# Altium schematic sheet LedDisp.SchDoc
size A3
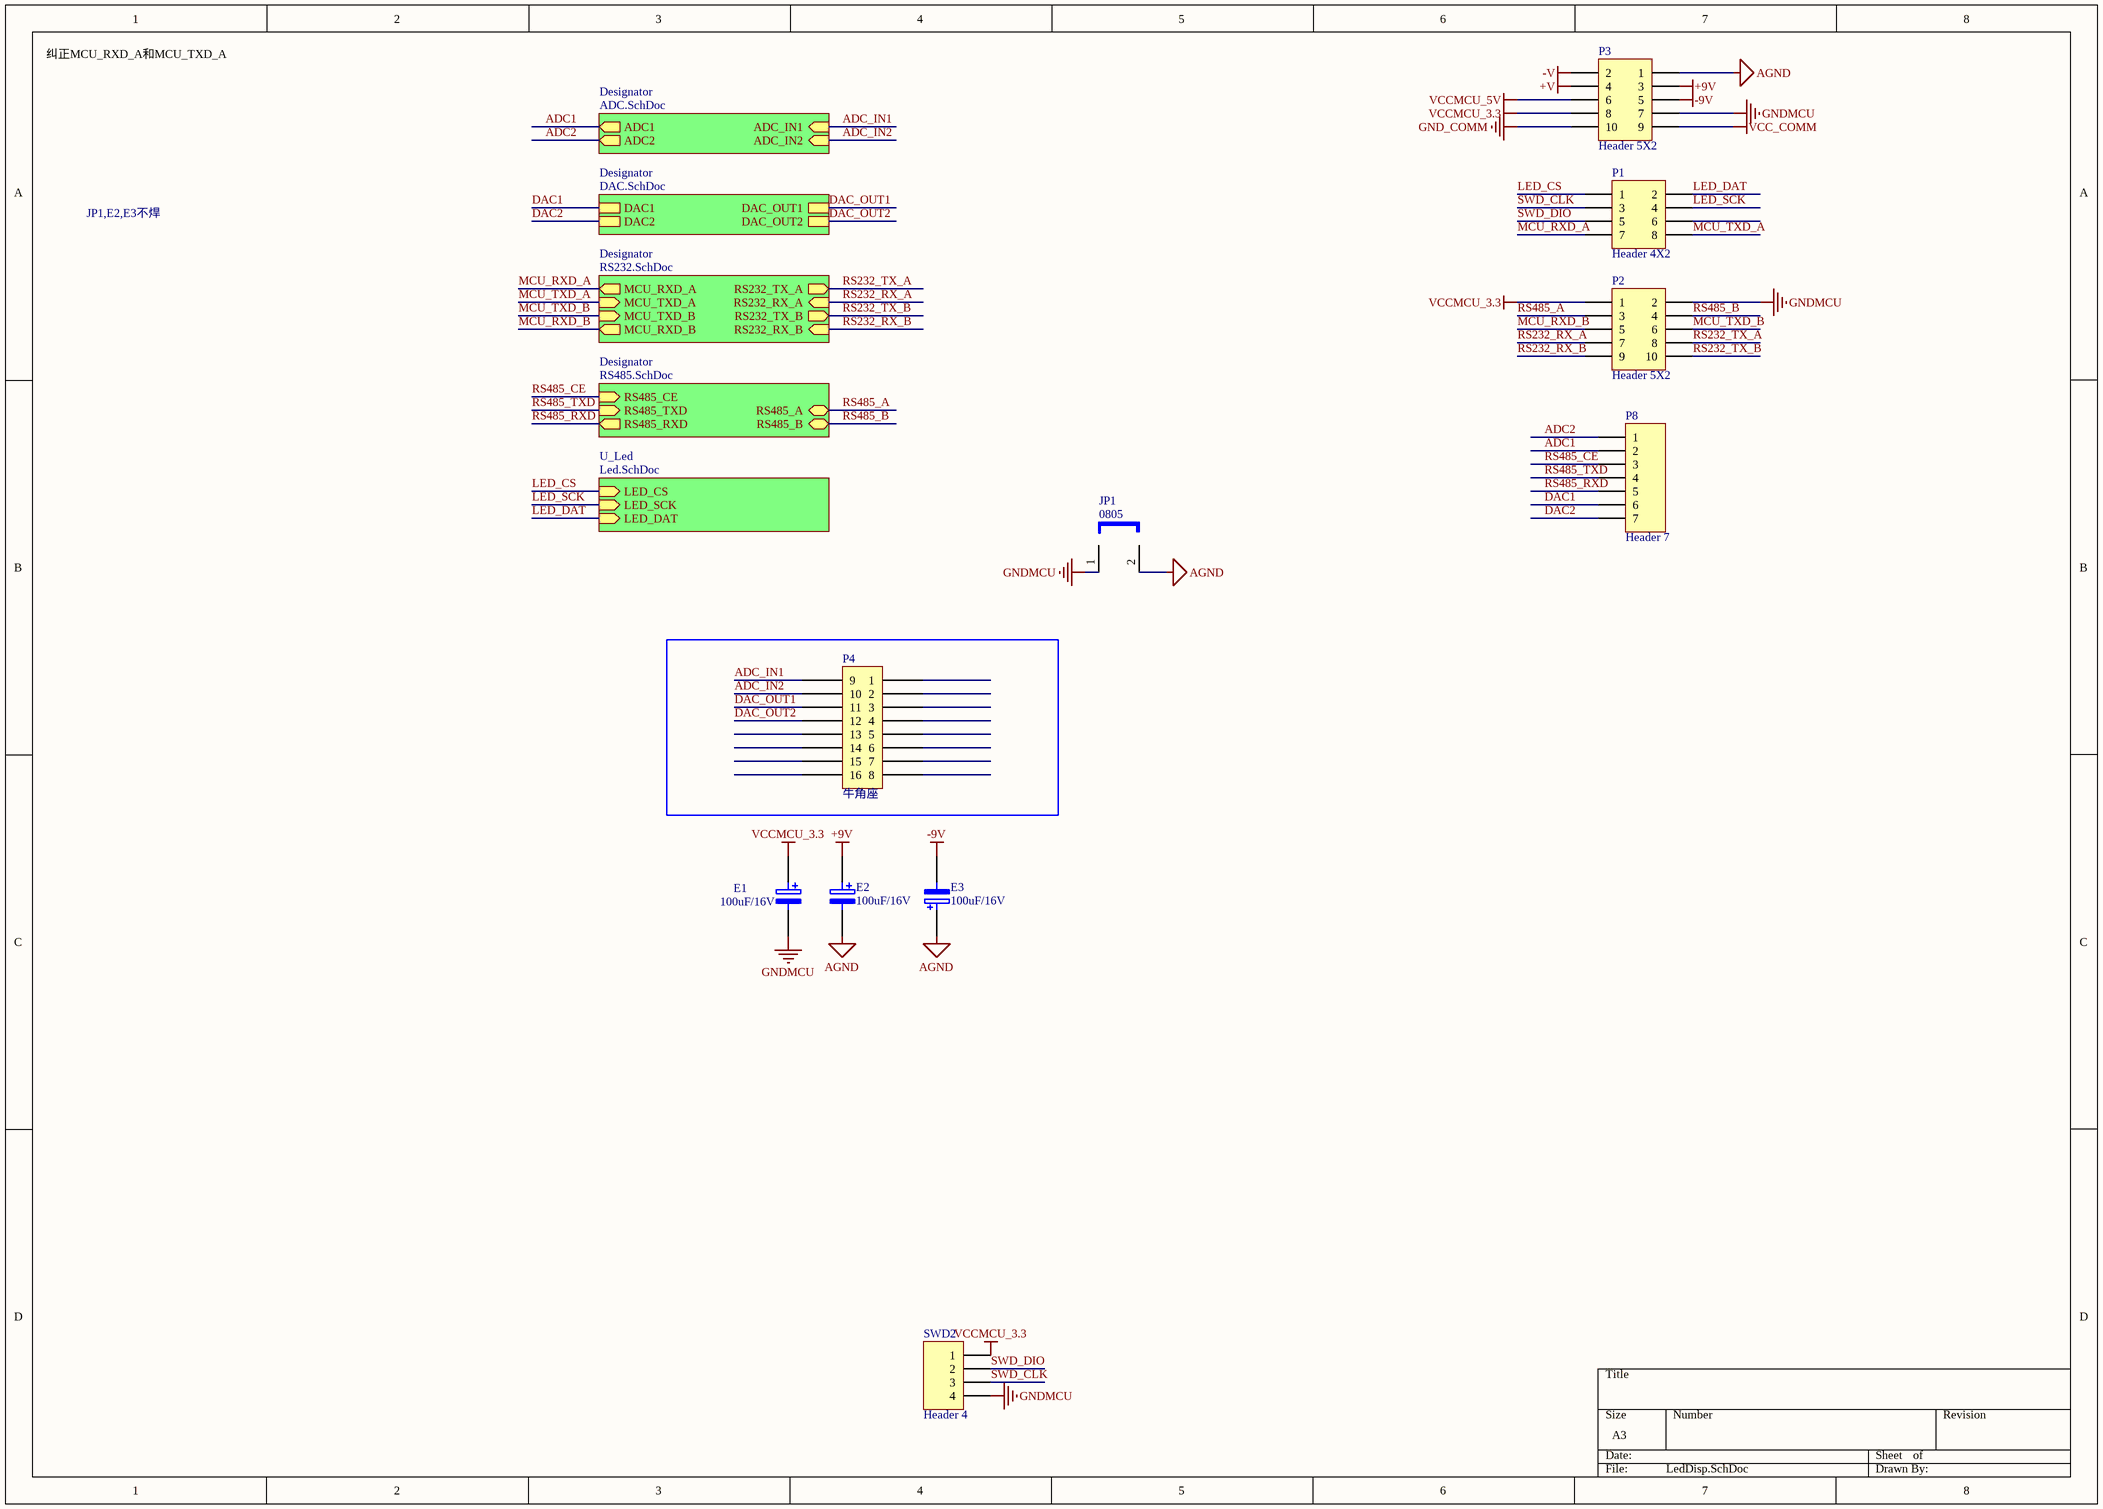
[diagram p0: LedDisp.SchDoc]

## Parts
E1  100uF/16V  [C-10UF]
E2  100uF/16V  [C-10UF]
E3  100uF/16V  [C-10UF]
JP1  0805  [RESC_E0805_2012X50N]
P1  Header 4X2  [HDR2X4]
P2  Header 5X2  [HDR2X5]
P3  Header 5X2  [HDR2X5]
P4  牛角座  [2.54* 2*8p]
P8  Header 7  [HDR1X7]
SWD2  Header 4  [HDR1X4]

## Sub-sheets
Designator = ADC.SchDoc: ADC1 (out), ADC_IN2 (in), ADC2 (out), ADC_IN1 (in)
Designator = DAC.SchDoc: DAC2, DAC1, DAC_OUT2, DAC_OUT1
Designator = RS232.SchDoc: RS232_RX_A (in), RS232_TX_A (out), RS232_TX_B (out), MCU_RXD_A (out), MCU_TXD_A (in), MCU_TXD_B (in), RS232_RX_B (in), MCU_RXD_B (out)
Designator = RS485.SchDoc: RS485_A (bidir), RS485_B (bidir), RS485_RXD (out), RS485_TXD (in), RS485_CE (in)
U_Led = Led.SchDoc: LED_CS (in), LED_SCK (in), LED_DAT (in)

## Nets
+9V: E2.1 P3.3
+V: P3.4
-9V: E3.2 P3.5
-V: P3.2
AGND: E2.2 E3.1 JP1.2 P3.1
GND_COMM: P3.10
GNDMCU: E1.2 JP1.1 P2.2 P3.7 SWD2.4
VCC_COMM: P3.9
VCCMCU_3.3: E1.1 P2.1 P3.8 SWD2.1
VCCMCU_5V: P3.6
ADC1: P8.2 ; sheet Designator/ADC1
ADC2: P8.1 ; sheet Designator/ADC2
ADC_IN1: P4.9 ; sheet Designator/ADC_IN1
ADC_IN2: P4.10 ; sheet Designator/ADC_IN2
DAC1: P8.6 ; sheet Designator/DAC1
DAC2: P8.7 ; sheet Designator/DAC2
DAC_OUT1: P4.11 ; sheet Designator/DAC_OUT1
DAC_OUT2: P4.12 ; sheet Designator/DAC_OUT2
LED_CS: P1.1 ; sheet U_Led/LED_CS
LED_DAT: P1.2 ; sheet U_Led/LED_DAT
LED_SCK: P1.4 ; sheet U_Led/LED_SCK
MCU_RXD_A: P1.7 ; sheet Designator/MCU_RXD_A
MCU_RXD_B: P2.5 ; sheet Designator/MCU_RXD_B
MCU_TXD_A: P1.8 ; sheet Designator/MCU_TXD_A
MCU_TXD_B: P2.6 ; sheet Designator/MCU_TXD_B
RS232_RX_A: P2.7 ; sheet Designator/RS232_RX_A
RS232_RX_B: P2.9 ; sheet Designator/RS232_RX_B
RS232_TX_A: P2.8 ; sheet Designator/RS232_TX_A
RS232_TX_B: P2.10 ; sheet Designator/RS232_TX_B
RS485_A: P2.3 ; sheet Designator/RS485_A
RS485_B: P2.4 ; sheet Designator/RS485_B
RS485_CE: P8.3 ; sheet Designator/RS485_CE
RS485_RXD: P8.5 ; sheet Designator/RS485_RXD
RS485_TXD: P8.4 ; sheet Designator/RS485_TXD
SWD_CLK: P1.3 SWD2.3
SWD_DIO: P1.5 SWD2.2

Not connected (* = marked no-connect by the designer): P1 6; P4 1 2 3 4 5 6 7 8 13 14 15 16

## Notes on the sheet
- 纠正MCU_RXD_A和MCU_TXD_A
- JP1,E2,E3不焊

## Library data of the parts
E1-E3 = ELECTRO2: Electrolytic Capacitor
JP1 = JUMPER
P1 = Header 4X2: Header, 4-Pin, Dual row; LatestRevisionDate: 17-Jul-2002; LatestRevisionNote: Re-released for DXP Platform.; Publisher: Altium Limited
P2 P3 = Header 5X2: Header, 5-Pin, Dual row; LatestRevisionDate: 17-Jul-2002; LatestRevisionNote: Re-released for DXP Platform.; Publisher: Altium Limited
P4 = CON2*8
P8 = Header 7: Header, 7-Pin; LatestRevisionDate: 17-Jul-2002; LatestRevisionNote: Re-released for DXP Platform.; Publisher: Altium Limited
SWD2 = Header 4: Header, 4-Pin; LatestRevisionDate: 17-Jul-2002; LatestRevisionNote: Re-released for DXP Platform.; Publisher: Altium Limited